# Altium project PCB_Project.PrjPcb
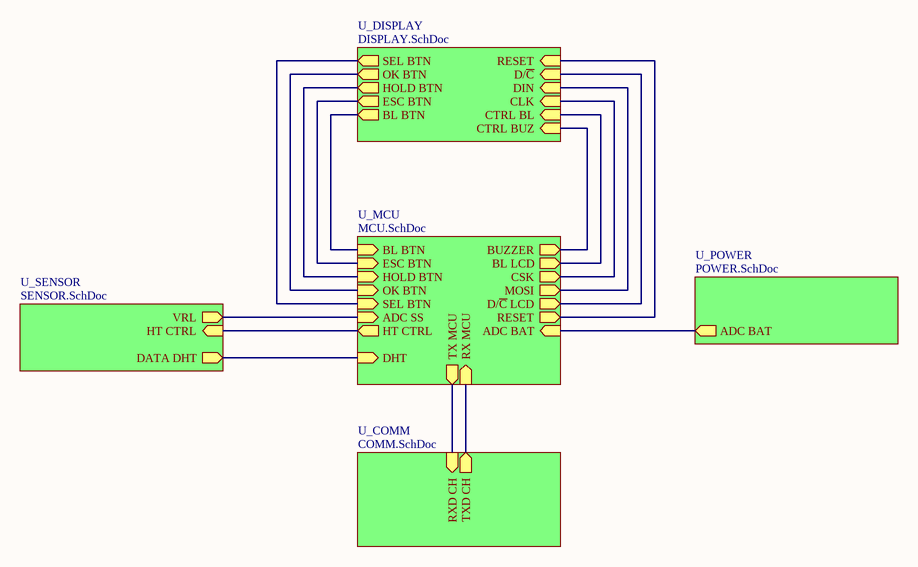
[diagram p0: Sheet1.SchDoc]
7 sheets, 85 parts. Net scope: hierarchical (ports join the sheet entries above them; power ports are global).
Sheets:
  Sheet1.SchDoc
    U_POWER = POWER.SchDoc
    U_SENSOR = SENSOR.SchDoc
    U_MCU = MCU.SchDoc
    U_DISPLAY = DISPLAY.SchDoc
    U_COMM = COMM.SchDoc
  Sheet2.SchDoc

## Sheet Sheet1.SchDoc
size A; SheetNumber: 1; SheetTotal: 7

### Sub-sheets
U_COMM = COMM.SchDoc: TXD CH (out), RXD CH (in)
U_DISPLAY = DISPLAY.SchDoc: RESET (in), D/~{C} (in), DIN (in), CLK (in), BL BTN (out), ESC BTN (out), HOLD BTN (out), OK BTN (out), SEL BTN (out), CTRL BL (in), CTRL BUZ (in)
U_MCU = MCU.SchDoc: BL BTN (in), ESC BTN (in), HOLD BTN (in), OK BTN (in), SEL BTN (in), BL LCD (out), CSK (out), MOSI (out), D/~{C} LCD (out), ADC SS (in), ADC BAT (in), RESET (out), BUZZER (out), HT CTRL (out), TX MCU (out), RX MCU (in), DHT (in)
U_POWER = POWER.SchDoc: ADC BAT (out)
U_SENSOR = SENSOR.SchDoc: VRL (out), HT CTRL (in), DATA DHT (out)

### Nets
ADC BAT: sheet U_POWER/ADC BAT, sheet U_MCU/ADC BAT
ADC SS: sheet U_SENSOR/VRL, sheet U_MCU/ADC SS
BL BTN: sheet U_MCU/BL BTN, sheet U_DISPLAY/BL BTN
BL LCD: sheet U_MCU/BL LCD, sheet U_DISPLAY/CTRL BL
CSK: sheet U_MCU/CSK, sheet U_DISPLAY/CLK
D/~{C} LCD: sheet U_MCU/D/~{C} LCD, sheet U_DISPLAY/D/~{C}
DATA DHT: sheet U_SENSOR/DATA DHT, sheet U_MCU/DHT
ESC BTN: sheet U_MCU/ESC BTN, sheet U_DISPLAY/ESC BTN
HOLD BTN: sheet U_MCU/HOLD BTN, sheet U_DISPLAY/HOLD BTN
MOSI: sheet U_MCU/MOSI, sheet U_DISPLAY/DIN
OK BTN: sheet U_MCU/OK BTN, sheet U_DISPLAY/OK BTN
RESET: sheet U_MCU/RESET, sheet U_DISPLAY/RESET
RXD CH: sheet U_MCU/TX MCU, sheet U_COMM/RXD CH
SEL BTN: sheet U_MCU/SEL BTN, sheet U_DISPLAY/SEL BTN
TXD CH: sheet U_MCU/RX MCU, sheet U_COMM/TXD CH
NetR7_2: sheet U_MCU/BUZZER, sheet U_DISPLAY/CTRL BUZ
NetR16_2: sheet U_SENSOR/HT CTRL, sheet U_MCU/HT CTRL

## Sheet POWER.SchDoc
size A; SheetNumber: 6; SheetTotal: 7
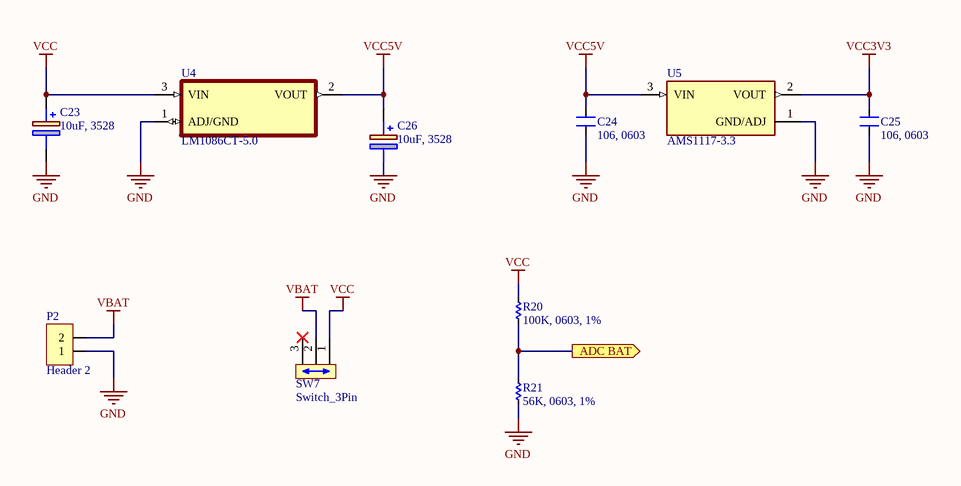
[diagram p1: POWER.SchDoc]

### Parts
C23  10uF, 3528  [CAP-TANTAL-3528]
C24  106, 0603  [SM-0603]
C25  106, 0603  [SM-0603]
C26  10uF, 3528  [CAP-TANTAL-3528]
P2  Header 2  [HDR/Header/2]
R20  100K, 0603, 1%  [RES-SMD-0603]
R21  56K, 0603, 1%  [RES-SMD-0603]
SW7  Switch_3Pin  [SW-12F23]
U4  LM1086CT-5.0  [TO254P1054X470X1955-3]
U5  AMS1117-3.3  [SOT229P700X180-4N]

### Ports
ADC BAT (out)

### Nets
GND: C23.2 C24.1 C25.1 C26.2 P2.1 R21.2 U4.1(ADJ/GND) U5.1(GND/ADJ)
VBAT: P2.2 SW7.2(COMMON)
VCC: C23.1 R20.1 SW7.1 U4.3(VIN)
VCC3V3: C25.2 U5.2(VOUT)
VCC5V: C24.2 C26.1 U4.2(VOUT) U5.3(VIN)
ADC BAT: R20.2 R21.1 ; port ADC BAT

Not connected (* = marked no-connect by the designer): SW7 3*

### Library data of the parts
C23 C26 = CAP Tantalum: Tantalum Capacitor
C24 C25 = CM: Cap SMD; Value: 103
P2 = Header 2: Header, 2-Pin
R20 R21 = Res-SMD: Resistor; Manufacturer: Generic Components; Class: Passive; Published: 08/06/2000; Publisher: Altium Hobart Technology Centre
SW7 = Switch_3Pin: Switch; Published: 24-Mar-1999; LatestRevisionDate: 17-Jul-2002; LatestRevisionNote: Re-released for DXP Platform.; PackageReference: SPST-2; Publisher: Altium Limited
U4 = LM1086CT-5.0: MF: {'manufacturer': u'Texas Instruments'}; MP: LM1086CT-5.0/NOPB; Package: None; Price: None; Value: *; Availability: Unavailable
U5 = AMS1117-3.3: MF: {'manufacturer': u'Advanced Monolithic Systems'}; Package: None; Price: None; Value: *; MP: AMS1117-3.3; Availability: Unavailable

## Sheet SENSOR.SchDoc
size A; SheetNumber: 4; SheetTotal: 7
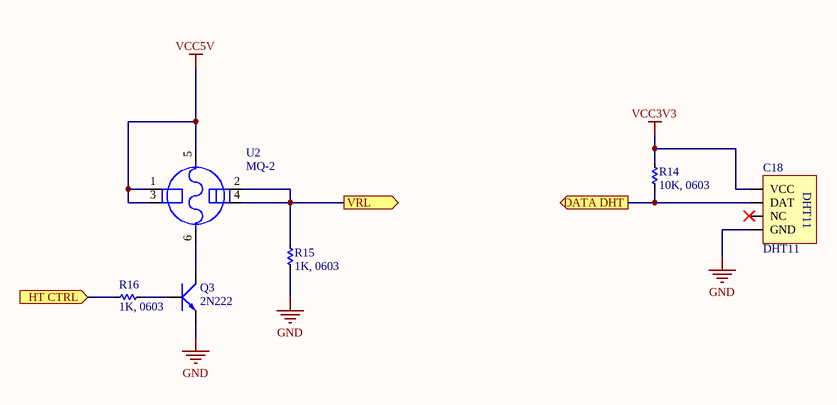
[diagram p2: SENSOR.SchDoc]

### Parts
C18  DHT11  [DHT11]
Q3  2N222  [TO92-123]
R14  10K, 0603  [RES-SMD-0603]
R15  1K, 0603  [RES-SMD-0603]
R16  1K, 0603  [RES-SMD-0603]
U2  MQ-2  [SNR6-D19.0MM]

### Ports
DATA DHT (out), HT CTRL (in), VRL (out)

### Nets
GND: C18.4(GND) Q3.1(E) R15.2
VCC3V3: C18.1(VCC) R14.2
VCC5V: U2.1(A0) U2.3(A1) U2.5(H@1)
ADC SS: R15.1 U2.2(B0) U2.4(B1) ; port VRL
DATA DHT: C18.2(DAT) R14.1 ; port DATA DHT
NetQ3_2: Q3.2(B) R16.1
NetQ3_3: Q3.3(C) U2.6(H@2)
NetR16_2: R16.2 ; port HT CTRL

Not connected (* = marked no-connect by the designer): C18 3(NC)*

### Library data of the parts
C18 = DHT11: Manufacturer: W¨¹rth Elektronik eiSos GmbH; partNo: 613004143121; ComponentLink1 Description: Manufacturer; ComponentLink2 Description: Datasheet; NoPins: 04; Created Date: 29 March 2013; ComponentLink1URL: http://www.we-online.com; ComponentLink2URL: http://katalog.we-online.de/em/datasheet/6130xx143121.pdf; Created by: Karrer Zheng
Q3 = 2N222: NPN 600mW, ECB; Value: C1815
R14-R16 = Res-SMD: as R20 on sheet POWER; Published: 08/06/2000; Publisher: Altium Hobart Technology Centre
U2 = DIP-GAS-MQ-2(6P-D19MM): 314100003; MF: {'manufacturer': u'AirBorn'}; Package: None; Price: None; Value: *; MP: MQ-2; Availability: Unavailable

## Sheet MCU.SchDoc
size B; SheetNumber: 2; SheetTotal: 7
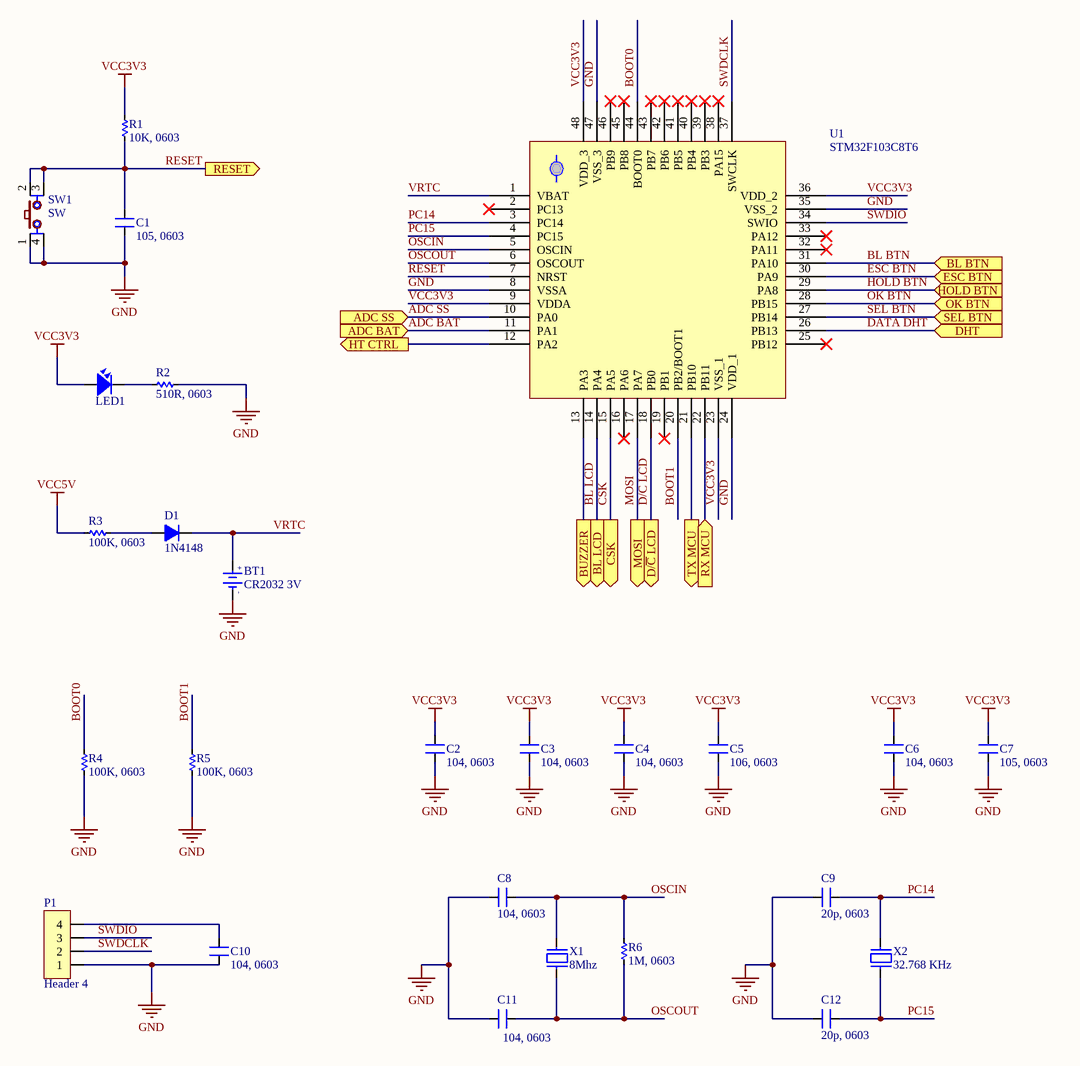
[diagram p3: MCU.SchDoc]

### Parts
BT1  CR2032 3V  [PIN3V]
C1  105, 0603  [SM-0603]
C2  104, 0603  [SM-0603]
C3  104, 0603  [SM-0603]
C4  104, 0603  [SM-0603]
C5  106, 0603  [SM-0603]
C6  104, 0603  [SM-0603]
C7  105, 0603  [SM-0603]
C8  104, 0603  [SM-0603]
C9  20p, 0603  [SM-0603]
C10  104, 0603  [SM-0603]
C11  104, 0603  [SM-0603]
C12  20p, 0603  [SM-0603]
D1  1N4148  [D0.5A]
LED1  LED  [LED-0805-Blue]  (value not drawn)
P1  Header 4  [HDR/Header/4]
R1  10K, 0603  [RES-SMD-0603]
R2  510R, 0603  [RES-SMD-0603]
R3  100K, 0603  [RES-SMD-0603]
R4  100K, 0603  [RES-SMD-0603]
R5  100K, 0603  [RES-SMD-0603]
R6  1M, 0603  [RES-SMD-0603]
SW1  SW  [SW2-SMD]
U1  STM32F103C8T6  [QFP50P900X900X160-48N]
X1  8Mhz  [XT2]
X2  32.768 KHz  [XT2-SMD]

### Ports
ADC BAT (in), ADC SS (in), BL BTN (in), BL LCD (out), BUZZER (out), CSK (out), D/~{C} LCD (out), DHT (in), ESC BTN (in), HOLD BTN (in), HT CTRL (out), MOSI (out), OK BTN (in), RESET (out), RX MCU (in), SEL BTN (in), TX MCU (out)

### Nets
GND: BT1.2(GND) C1.1 C2.1 C3.1 C4.1 C5.1 C6.1 C7.1 C8.1 C9.2 C10.1 C11.2 C12.2 P1.1 R2.2 R4.2 R5.2 SW1.1 SW1.4 U1.8(VSSA) U1.24(VDD_1) U1.35(VSS_2) U1.47(VSS_3)
VCC3V3: C2.2 C3.2 C4.2 C5.2 C6.2 C7.2 LED1.1 R1.2 U1.9(VDDA) U1.23(VSS_1) U1.36(VDD_2) U1.48(VDD_3)
VCC5V: R3.1
ADC BAT: U1.11(PA1) ; port ADC BAT
ADC SS: U1.10(PA0) ; port ADC SS
BL BTN: U1.31(PA10) ; port BL BTN
BL LCD: U1.14(PA4) ; port BL LCD
BOOT0: R4.1 U1.44(BOOT0)
BOOT1: R5.1 U1.20(PB2/BOOT1)
CSK: U1.15(PA5) ; port CSK
D/~{C} LCD: U1.18(PB0) ; port D/~{C} LCD
DATA DHT: U1.26(PB13) ; port DHT
ESC BTN: U1.30(PA9) ; port ESC BTN
HOLD BTN: U1.29(PA8) ; port HOLD BTN
MOSI: U1.17(PA7) ; port MOSI
OK BTN: U1.28(PB15) ; port OK BTN
OSCIN: C8.2 R6.1 U1.5(OSCIN) X1.2
OSCOUT: C11.1 R6.2 U1.6(OSCOUT) X1.1
PC14: C9.1 U1.3(PC14) X2.2
PC15: C12.1 U1.4(PC15) X2.1
RESET: C1.2 R1.1 SW1.2 SW1.3 U1.7(NRST) ; port RESET
RXD CH: U1.21(PB10) ; port TX MCU
SEL BTN: U1.27(PB14) ; port SEL BTN
SWDCLK: P1.2 U1.37(SWCLK)
SWDIO: P1.3 U1.34(SWIO)
TXD CH: U1.22(PB11) ; port RX MCU
VRTC: BT1.1(+3V) D1.2(K) U1.1(VBAT)
NetC10_2: C10.2 P1.4
NetD1_1: D1.1(A) R3.2
NetLED1_2: LED1.2 R2.1
NetR7_2: U1.13(PA3) ; port BUZZER
NetR16_2: U1.12(PA2) ; port HT CTRL

Not connected (* = marked no-connect by the designer): U1 2(PC13)* 16(PA6)* 19(PB1)* 25(PB12)* 32(PA11)* 33(PA12)* 38(PA15)* 39(PB3)* 40(PB4)* 41(PB5)* 42(PB6)* 43(PB7)* 45(PB8)* 46(PB9)*

### Notes on the sheet
- (in symbol PIN 3V) +; -

### Library data of the parts
BT1 = PIN 3V: CR2032 3VDC rechargeable; Value: PIN 3V
C1-C12 = CM: Cap SMD; Value: 103
D1 = D0.5A: Value: 1N4148
LED1 = LED SMD: Value: LED 3 - 5 ly 2 Colour
P1 = Header 4: Header, 4-Pin
R1-R6 = Res-SMD: as R20 on sheet POWER; Published: 08/06/2000; Publisher: Altium Hobart Technology Centre
SW1 = SW4: Switch button 4 pin; Value: Button chip 4 pin
X1 = XT2: Crystal For all Crystal 2pin.; Value: 4Mhz
X2 = XT2: Crystal, 32.768 KHz, -40 to 85 degC, 3.2 x 1.5 x 0.9 mm SMD; Value: 4Mhz

## Sheet DISPLAY.SchDoc
size A; SheetNumber: 3; SheetTotal: 7
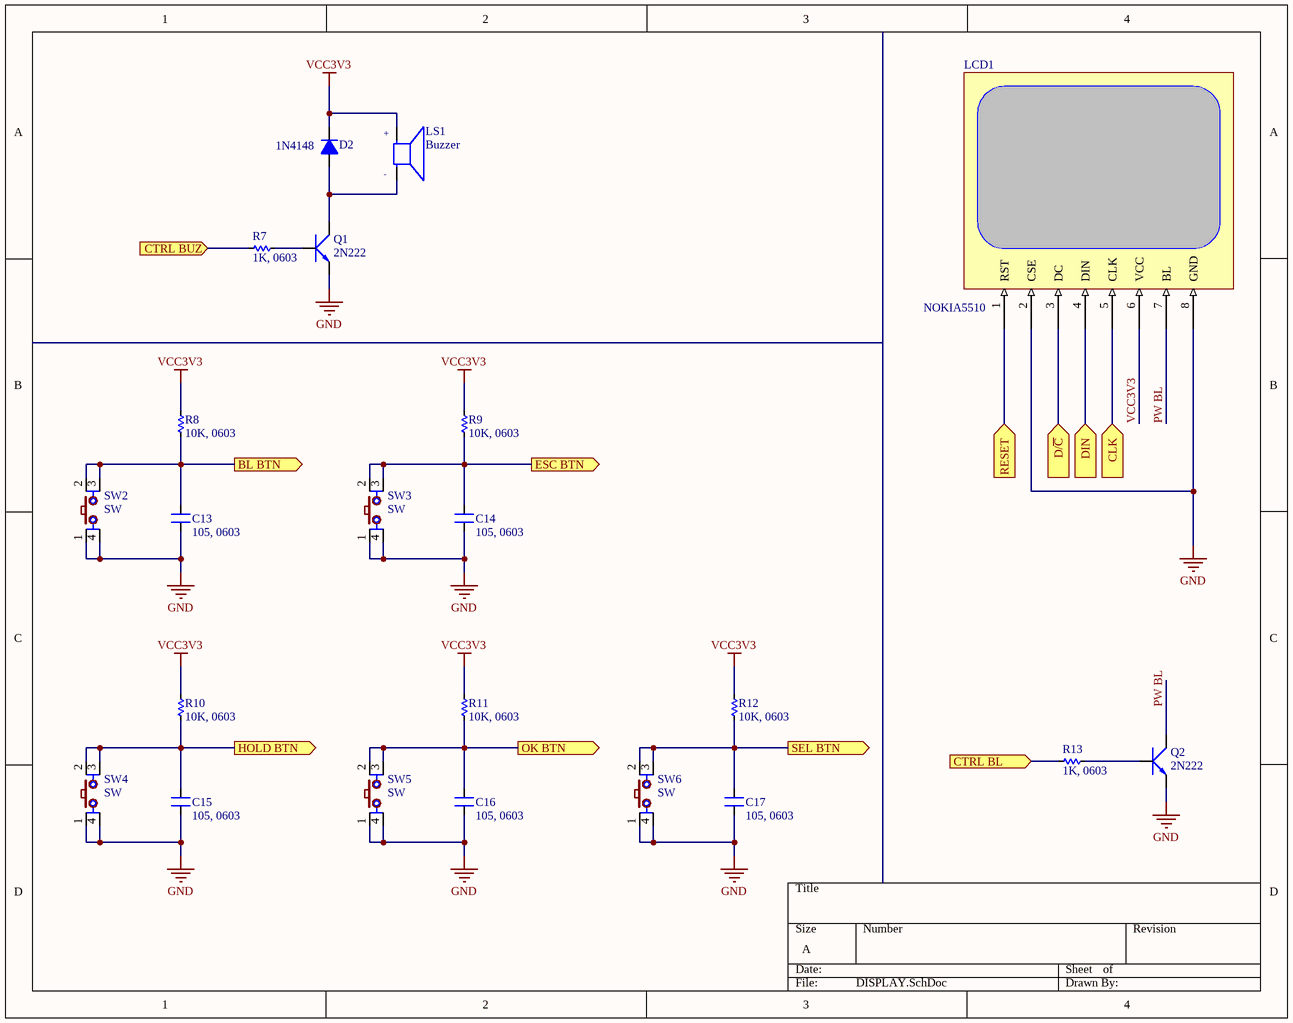
[diagram p4: DISPLAY.SchDoc]

### Parts
C13  105, 0603  [SM-0603]
C14  105, 0603  [SM-0603]
C15  105, 0603  [SM-0603]
C16  105, 0603  [SM-0603]
C17  105, 0603  [SM-0603]
D2  1N4148  [D0.5A]
LCD1  NOKIA5510
LS1  Buzzer  [XDCR_AI-1027-TWT-3V-R]
Q1  2N222  [TO92-123]
Q2  2N222  [TO92-123]
R7  1K, 0603  [RES-SMD-0603]
R8  10K, 0603  [RES-SMD-0603]
R9  10K, 0603  [RES-SMD-0603]
R10  10K, 0603  [RES-SMD-0603]
R11  10K, 0603  [RES-SMD-0603]
R12  10K, 0603  [RES-SMD-0603]
R13  1K, 0603  [RES-SMD-0603]
SW2  SW  [SW2-SMD]
SW3  SW  [SW2-SMD]
SW4  SW  [SW2-SMD]
SW5  SW  [SW2-SMD]
SW6  SW  [SW2-SMD]

### Ports
BL BTN (out), CLK (in), CTRL BL (in), CTRL BUZ (in), D/~{C} (in), DIN (in), ESC BTN (out), HOLD BTN (out), OK BTN (out), RESET (in), SEL BTN (out)

### Nets
GND: C13.1 C14.1 C15.1 C16.1 C17.1 LCD1.2(CSE) LCD1.8(GND) Q1.1(E) Q2.1(E) SW2.1 SW2.4 SW3.1 SW3.4 SW4.1 SW4.4 SW5.1 SW5.4 SW6.1 SW6.4
VCC3V3: D2.2(K) LCD1.6(VCC) LS1.P R8.2 R9.2 R10.2 R11.2 R12.2
BL BTN: C13.2 R8.1 SW2.2 SW2.3 ; port BL BTN
BL LCD: R13.2 ; port CTRL BL
CSK: LCD1.5(CLK) ; port CLK
D/~{C} LCD: LCD1.3(DC) ; port D/~{C}
ESC BTN: C14.2 R9.1 SW3.2 SW3.3 ; port ESC BTN
HOLD BTN: C15.2 R10.1 SW4.2 SW4.3 ; port HOLD BTN
MOSI: LCD1.4(DIN) ; port DIN
OK BTN: C16.2 R11.1 SW5.2 SW5.3 ; port OK BTN
PW BL: LCD1.7(BL) Q2.3(C)
RESET: LCD1.1(RST) ; port RESET
SEL BTN: C17.2 R12.1 SW6.2 SW6.3 ; port SEL BTN
NetD2_1: D2.1(A) LS1.N Q1.3(C)
NetQ1_2: Q1.2(B) R7.1
NetQ2_2: Q2.2(B) R13.1
NetR7_2: R7.2 ; port CTRL BUZ

### Notes on the sheet
- (in symbol AI-1027-TWT-3V-R) +; -

### Library data of the parts
C13-C17 = CM: Cap SMD; Value: 103
D2 = D0.5A: Value: 1N4148
LS1 = AI-1027-TWT-3V-R: MF: {'manufacturer': u'PUI Audio,'}; Package: None; Price: None; Value: *; MP: AI-1027-TWT-3V-R; Availability: Unavailable
Q1 Q2 = 2N222: NPN 600mW, ECB; Value: C1815
R7-R13 = Res-SMD: as R20 on sheet POWER; Published: 08/06/2000; Publisher: Altium Hobart Technology Centre
SW2-SW6 = SW4: as SW1 on sheet MCU

## Sheet COMM.SchDoc
size A; SheetNumber: 5; SheetTotal: 7
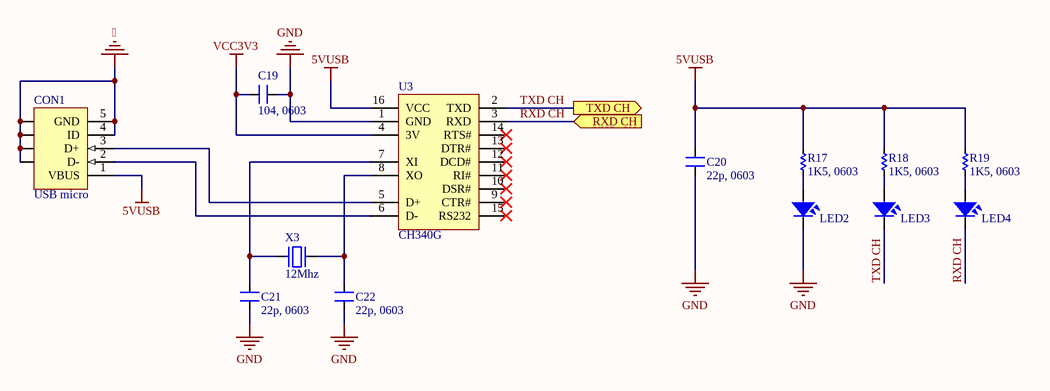
[diagram p5: COMM.SchDoc]

### Parts
C19  104, 0603  [SM-0603]
C20  22p, 0603  [SM-0603]
C21  22p, 0603  [SM-0603]
C22  22p, 0603  [SM-0603]
CON1  USB micro  [CONN/USB/MICRO/RA]
LED2  LED  [LED-0805-Blue]  (value not drawn)
LED3  LED  [LED-0805-Blue]  (value not drawn)
LED4  LED  [LED-0805-Blue]  (value not drawn)
R17  1K5, 0603  [RES-SMD-0603]
R18  1K5, 0603  [RES-SMD-0603]
R19  1K5, 0603  [RES-SMD-0603]
U3  CH340G  [SO16]
X3  12Mhz  [XT2]

### Ports
RXD CH (in), TXD CH (out)

### Nets
5VUSB: C20.2 CON1.1(VBUS) R17.1 R18.1 R19.1 U3.16(VCC)
: CON1.4(ID) CON1.5(GND) CON1.6(SHLD) CON1.7(SHLD) CON1.8(SHLD) CON1.9(SHLD)
GND: C19.1 C20.1 C21.1 C22.1 LED2.2 U3.1(GND)
VCC3V3: C19.2 U3.4(3V)
RXD CH: LED4.2 U3.3(RXD) ; port RXD CH
TXD CH: LED3.2 U3.2(TXD) ; port TXD CH
NetC21_2: C21.2 U3.7(XI) X3.1
NetC22_2: C22.2 U3.8(XO) X3.2
NetCON1_2: CON1.2(D-) U3.6(D-)
NetCON1_3: CON1.3(D+) U3.5(D+)
NetLED2_1: LED2.1 R17.2
NetLED3_1: LED3.1 R18.2
NetLED4_1: LED4.1 R19.2

Not connected (* = marked no-connect by the designer): U3 9(CTR#)* 10(DSR#)* 11(RI#)* 12(DCD#)* 13(DTR#)* 14(RTS#)* 15(RS232)*

### Library data of the parts
C19-C22 = CM: Cap SMD; Value: 103
CON1 = CON USB micro: USB micro, 5 pins
LED2-LED4 = LED SMD: Value: LED 3 - 5 ly 2 Colour
R17-R19 = Res-SMD: as R20 on sheet POWER; Published: 08/06/2000; Publisher: Altium Hobart Technology Centre
U3 = CH340G: High and Low Side Driver; Note: Pins 4, 8 and 14 are not connected; Published: 8-Jun-2000; LatestRevisionDate: 04-Mar-2005; LatestRevisionNote: Stylized 3D Model Added.; DatasheetVersion: PD60147J; PackageReference: PDIP14; Publisher: Altium Limited; PackageDescription: DIP; 14 Leads; Row Spacing 7.62 mm; Pitch 2.54 mm; ComponentLink1Description: Manufacturer Link; ComponentLink1URL: http://www.irf.com/; ComponentLink2Description: Datasheet; ComponentLink2URL: http://www.irf.com/product-info/datasheets/data/ir2110.pdf
X3 = XT2: as X2 on sheet MCU

## Sheet Sheet2.SchDoc
size A; SheetNumber: 7; SheetTotal: 7
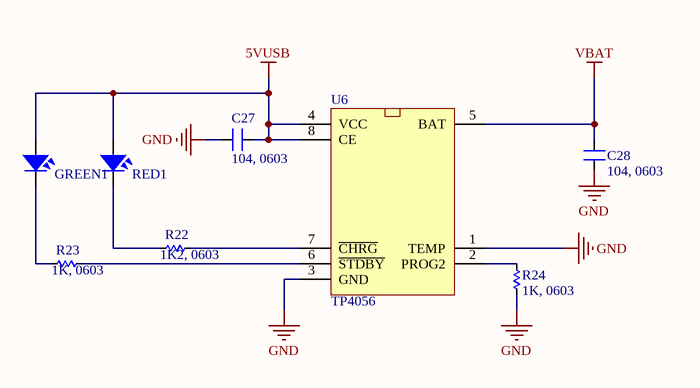
[diagram p6: Sheet2.SchDoc]

### Parts
C27  104, 0603  [SM-0603]
C28  104, 0603  [SM-0603]
GREEN1  LED  [LED-0805-Blue]  (value not drawn)
R22  1K2, 0603  [RES-SMD-0603]
R23  1K, 0603  [RES-SMD-0603]
R24  1K, 0603  [RES-SMD-0603]
RED1  LED  [LED-0805-Blue]  (value not drawn)
U6  TP4056  [SOP8_L]

### Nets
5VUSB: C27.1 GREEN1.1 RED1.1 U6.4(VCC) U6.8(CE)
GND: C27.2 C28.2 R24.2 U6.1(TEMP) U6.3(GND)
VBAT: C28.1 U6.5(BAT)
NetGREEN1_2: GREEN1.2 R23.2
NetR22_1: R22.1 U6.7(~{CHRG})
NetR22_2: R22.2 RED1.2
NetR23_1: R23.1 U6.6(~{STDBY})
NetR24_1: R24.1 U6.2(PROG2)

### Library data of the parts
C27 C28 = CM: Cap SMD; Value: 103
GREEN1 RED1 = LED SMD: Value: LED 3 - 5 ly 2 Colour
R22-R24 = Res-SMD: as R20 on sheet POWER; Published: 08/06/2000; Publisher: Altium Hobart Technology Centre
U6 = TP4056: 1A Standalone Linear Li-lon Battery Charger with Thermal   Regulation

## Nets that join several sheets
5VUSB: COMM (6 pins), Sheet2 (5 pins)
GND: POWER (8 pins), SENSOR (C18.4 Q3.1 R15.2), MCU (23 pins), DISPLAY (19 pins), COMM (6 pins), Sheet2 (5 pins)
VBAT: POWER (P2.2 SW7.2), Sheet2 (C28.1 U6.5)
VCC3V3: POWER (C25.2 U5.2), SENSOR (C18.1 R14.2), MCU (12 pins), DISPLAY (8 pins), COMM (C19.2 U3.4)
VCC5V: POWER (C24.2 C26.1 U4.2 U5.3), SENSOR (U2.1 U2.3 U2.5), MCU (R3.1)
ADC BAT: POWER (R20.2 R21.1), MCU (U1.11)
ADC SS: SENSOR (R15.1 U2.2 U2.4), MCU (U1.10)
BL BTN: MCU (U1.31), DISPLAY (C13.2 R8.1 SW2.2 SW2.3)
BL LCD: MCU (U1.14), DISPLAY (R13.2)
CSK: MCU (U1.15), DISPLAY (LCD1.5)
D/~{C} LCD: MCU (U1.18), DISPLAY (LCD1.3)
DATA DHT: SENSOR (C18.2 R14.1), MCU (U1.26)
ESC BTN: MCU (U1.30), DISPLAY (C14.2 R9.1 SW3.2 SW3.3)
HOLD BTN: MCU (U1.29), DISPLAY (C15.2 R10.1 SW4.2 SW4.3)
MOSI: MCU (U1.17), DISPLAY (LCD1.4)
NetR7_2: MCU (U1.13), DISPLAY (R7.2)
NetR16_2: SENSOR (R16.2), MCU (U1.12)
OK BTN: MCU (U1.28), DISPLAY (C16.2 R11.1 SW5.2 SW5.3)
RESET: MCU (5 pins), DISPLAY (LCD1.1)
RXD CH: MCU (U1.21), COMM (LED4.2 U3.3)
SEL BTN: MCU (U1.27), DISPLAY (C17.2 R12.1 SW6.2 SW6.3)
TXD CH: MCU (U1.22), COMM (LED3.2 U3.2)